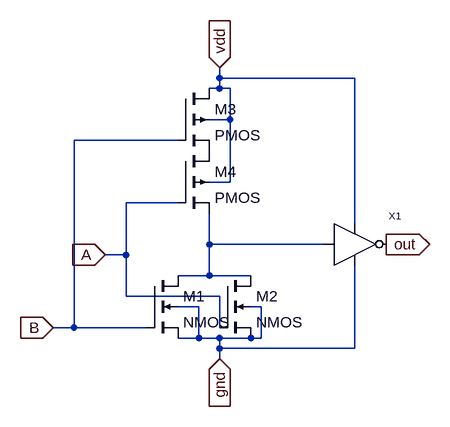
[diagram p0: schematic or.asc]
or.asc, the LTspice schematic file:
Version 4.1
SHEET 1 880 680
WIRE 352 -224 352 -240
WIRE 560 -224 352 -224
WIRE 352 -208 352 -224
WIRE 352 -208 336 -208
WIRE 368 -208 352 -208
WIRE 368 -160 368 -208
WIRE 368 -160 336 -160
WIRE 288 -128 128 -128
WIRE 368 -64 368 -160
WIRE 368 -64 336 -64
WIRE 288 -32 208 -32
WIRE 560 0 560 -224
WIRE 336 32 336 -16
WIRE 512 32 336 32
WIRE 208 48 208 -32
WIRE 208 48 176 48
WIRE 336 80 336 32
WIRE 336 80 288 80
WIRE 400 80 336 80
WIRE 208 112 208 48
WIRE 352 112 208 112
WIRE 320 128 288 128
WIRE 416 128 400 128
WIRE 128 160 128 -128
WIRE 128 160 96 160
WIRE 240 160 128 160
WIRE 352 160 352 112
WIRE 320 176 320 128
WIRE 320 176 288 176
WIRE 352 176 320 176
WIRE 400 176 352 176
WIRE 416 176 416 128
WIRE 416 176 400 176
WIRE 352 192 352 176
WIRE 560 192 560 64
WIRE 560 192 352 192
WIRE 352 208 352 192
FLAG 608 32 out
IOPIN 608 32 Out
FLAG 96 160 B
IOPIN 96 160 In
FLAG 352 208 gnd
IOPIN 352 208 In
FLAG 176 48 A
IOPIN 176 48 In
FLAG 352 -240 vdd
IOPIN 352 -240 In
SYMBOL nmos4 240 80 R0
SYMATTR InstName M1
SYMBOL nmos4 352 80 R0
SYMATTR InstName M2
SYMBOL pmos4 288 -208 R0
SYMATTR InstName M3
SYMBOL pmos4 288 -112 R0
SYMATTR InstName M4
SYMBOL inv 560 32 R0
SYMATTR InstName X1

The netlist it stands for:
* or.asc
M1 N001 B gnd gnd NMOS
M2 N001 A gnd gnd NMOS
M3 vdd B P001 vdd PMOS
M4 P001 A N001 vdd PMOS
X§X1 out N001 vdd gnd inv  ; pins out in vdd gnd
.model NMOS NMOS
.model PMOS PMOS
.lib standard.mos
.backanno
.end